# Altium schematic sheet Weatstone bridge.SchDoc: Weatstone bridge
size A4; Revision: 1; SheetNumber: 4; SheetTotal: 4
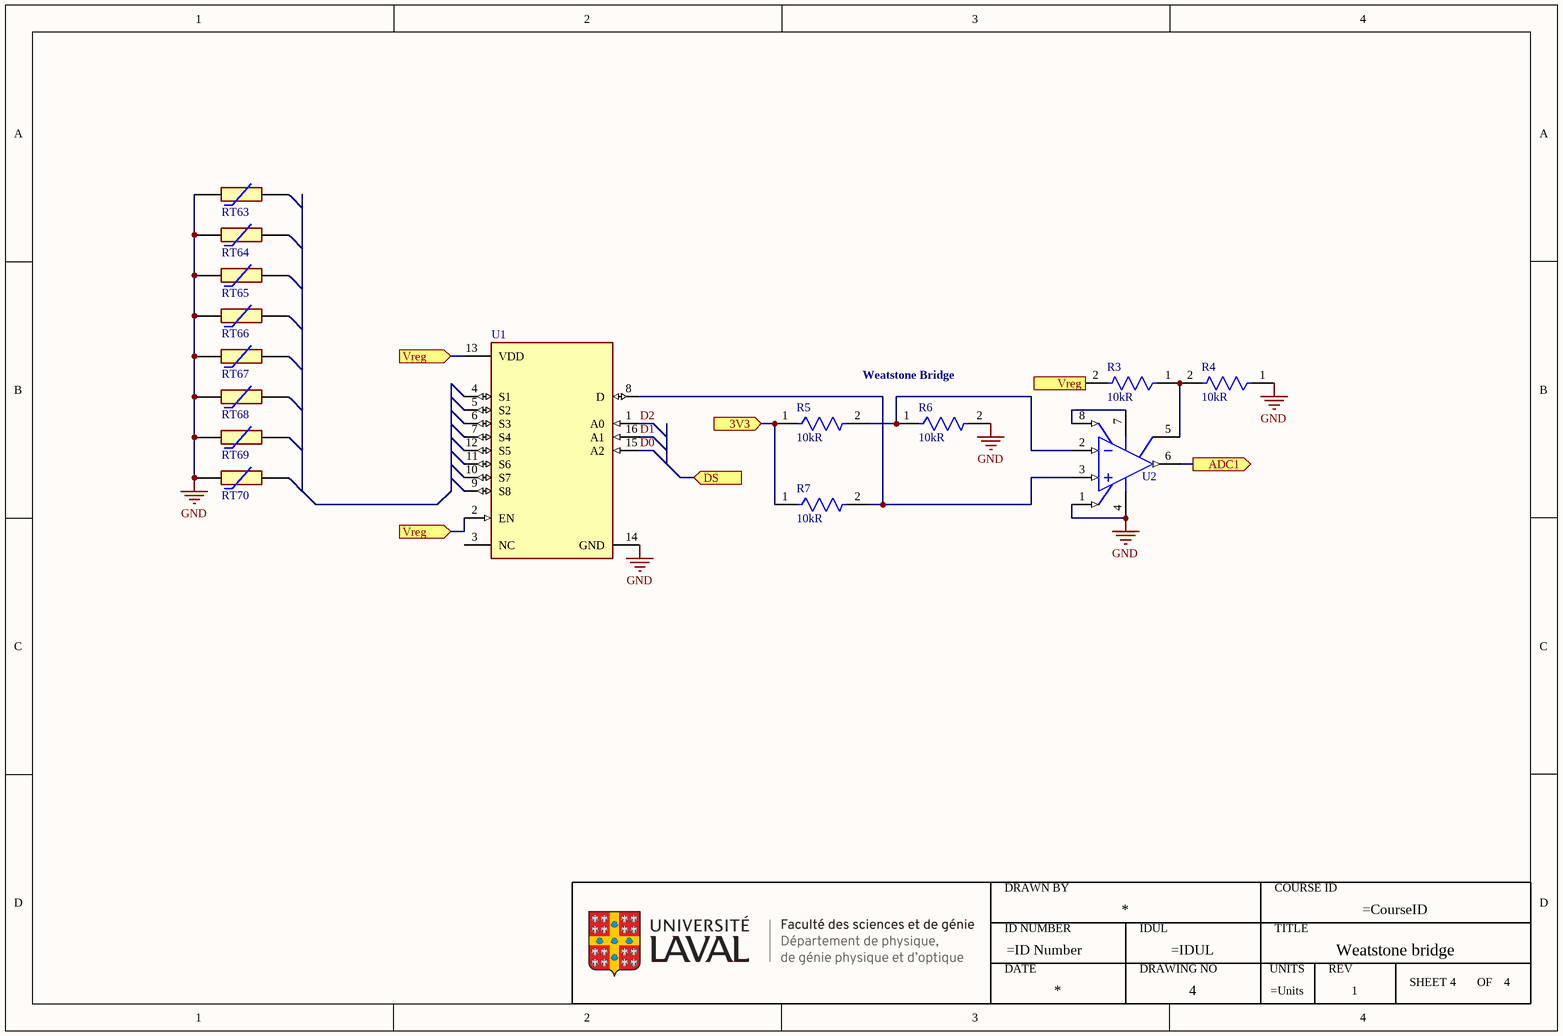
[diagram p0: Weatstone bridge.SchDoc]

## Parts
*3  ULaval FSG-DPGPO  (value not drawn)
R3  value 10kR  [FP-RT0603-IPC_C]  (hidden comment: RT0603BRD0710KL)
R4  value 10kR  [FP-RT0603-IPC_C]  (hidden comment: RT0603BRD0710KL)
R5  value 10kR  [FP-RT0603-IPC_C]  (hidden comment: RT0603BRD0710KL)
R6  value 10kR  [FP-RT0603-IPC_C]  (hidden comment: RT0603BRD0710KL)
R7  value 10kR  [FP-RT0603-IPC_C]  (hidden comment: RT0603BRD0710KL)
RT63  NTCLE350E4103FHB0  [NTCLE350E4103FHB0]  (value not drawn)
RT64  NTCLE350E4103FHB0  [NTCLE350E4103FHB0]  (value not drawn)
RT65  NTCLE350E4103FHB0  [NTCLE350E4103FHB0]  (value not drawn)
RT66  NTCLE350E4103FHB0  [NTCLE350E4103FHB0]  (value not drawn)
RT67  NTCLE350E4103FHB0  [NTCLE350E4103FHB0]  (value not drawn)
RT68  NTCLE350E4103FHB0  [NTCLE350E4103FHB0]  (value not drawn)
RT69  NTCLE350E4103FHB0  [NTCLE350E4103FHB0]  (value not drawn)
RT70  NTCLE350E4103FHB0  [NTCLE350E4103FHB0]  (value not drawn)
U1  TMUX1208PWR  [FP-PW0016A-IPC_B]  (value not drawn)
U2  MCP6N11-100E/SN  [SOIC-SN8_L]  (value not drawn)

## Ports
3V3 (in, see Power Supply Unit[4B], Processing interface[1A], Processing interface[1B], Processing interface[1C], Processing interface[4A], Processing interface[4B], Processing interface[4C]), ADC1 (out, see Processing interface[1A], Processing interface[1B], Processing interface[1C], Processing interface[4A], Processing interface[4B], Processing interface[4C], Processing interface[4D]), DS (in, see Processing interface[2B]), Vreg (in, see Power Supply Unit[3B], Processing interface[1A], Processing interface[1B], Processing interface[1C], Processing interface[3C], Processing interface[4A], Processing interface[4B], Processing interface[4C], Processing interface[4D], Weatstone bridge[2B], Weatstone bridge[2C]), Vreg (in, see Power Supply Unit[3B], Processing interface[1A], Processing interface[1B], Processing interface[1C], Processing interface[3C], Processing interface[4A], Processing interface[4B], Processing interface[4C], Processing interface[4D], Weatstone bridge[2B], Weatstone bridge[3B]), Vreg (in, see Power Supply Unit[3B], Processing interface[1A], Processing interface[1B], Processing interface[1C], Processing interface[3C], Processing interface[4A], Processing interface[4B], Processing interface[4C], Processing interface[4D], Weatstone bridge[2C], Weatstone bridge[3B])

## Nets
GND: R4.1 R6.2 RT63.1 RT64.1 RT65.1 RT66.1 RT67.1 RT68.1 RT69.1 RT70.1 U1.14(GND) U2.1(VFG) U2.4(VSS)
3V3: R5.1 R7.1 ; port 3V3
ADC1: U2.6(VOUT) ; port ADC1
D0: U1.15(A2)
D1: U1.16(A1)
D2: U1.1(A0)
Vreg: R3.2 U1.2(EN) U1.13(VDD) ; port Vreg
NetR3_1: R3.1 R4.2 U2.5(VREF)
NetR5_2: R5.2 R6.1 U2.2(VIM)
NetR7_2: R7.2 U1.8(D) U2.3(VIP)
NetU2_7: U2.7(VDD) U2.8(EN/~{CAL})

Not connected (* = marked no-connect by the designer): RT63 2; RT64 2; RT65 2; RT66 2; RT67 2; RT68 2; RT69 2; RT70 2; U1 3(NC) 4(S1) 5(S2) 6(S3) 7(S4) 9(S8) 10(S7) 11(S6) 12(S5)

## Notes on the sheet
- Weatstone Bridge
- (in symbol ULaval FSG-DPGPO) DRAWN BY; COURSE ID; ID NUMBER; IDUL; TITLE; DATE; DRAWING NO; UNITS; REV; SHEET; OF

## Library data of the parts
R3-R7 = CMP-009-00178-1: Res High precision Thin Film 0603 10K Ohm 0.1% 1/10W ±25ppm/°C Molded SMD Paper T/R; Max Power Dissipation: 100mW; Working Voltage: 75V; RoHS Compliant: Yes; Power Rating: 100mW; Lead Free: Lead Free; Depth: 0.8mm; Case Code (Imperial): 0603; Max Operating Temperature: 155°C; Voltage Rating: 75V; Package Quantity: 5000; Packaging: Tape and Reel; Case/Package: 0603; Height: 0.022inch; Construction: Rectangular; Min Operating Temperature: -55°C; Termination: SMD/SMT; Features: Moisture Resistant; Number of Terminations: 2; Case Code (Metric): 1608; Technology: THIN FILM; Military Standard: Not; Length: 0.063inch; Voltage Rating (DC): 75V; Temperature Coefficient: 25ppm/°C; Weight: 7.1E-05oz; Width: 0.8mm; Series: RT; Resistor Type: Thin Film
RT63-RT70 = NTCLE350E4103FHB0: Thermistor; Manufacturer_Name: Vishay; Datasheet Link: https://www.vishay.com/docs/29218/ntcle350e4.pdf; Height: 7mm; Manufacturer_Part_Number: NTCLE350E4103FHB0
U1 = CMP-015-00012-1: 5-V, 8: 1, 1-channel general-purpose analog multiplexer with 1.8-V input logic 16-TSSOP -40 to 125; RoHS Compliant: Yes
U2 = CMP-014-00010-1: MCP6N11 Series Single Channel 500 KHz 5.5 V Instrumentation Amplifier - SOIC-8; Bandwidth: 500kHz; Min Supply Voltage: 1.8V; Number of Elements: 2; Gain Bandwidth Product: 35MHz; Input Offset Voltage (Vos): 350uV; Number of Channels: 1; Nominal Supply Current: 800uA; Common Mode Rejection Ratio: 86dB; Slew Rate: 6V/µs; Max Supply Voltage: 5.5V; Slew Rate-Nom: 9V/µs; Input Bias Current: 10pA; Mounting Technology: Surface Mount; Package Quantity: 100; Pins: 8; Width: 3.9mm; Length: 4.9mm; Case/Package: SOIC; Min Operating Temperature: -40°C; Radiation Hardening: No; RoHS Compliant: Yes; Unity Gain Bandwidth Product: 35MHz; Lead Free: Lead Free; Number of Amplifiers: 1; Max Operating Temperature: 125°C; Height: 1.25mm; Packaging: Rail/Tube; Input Offset Voltage-Max: 350uV; Reach SVHC Compliant: Yes; Supply Current: 800uA; Max Supply Current: 800uA; Power Supply Rejection Ratio (PSRR): 86dB; Number of Circuits: 1